# Altium schematic sheet IB_V2_POWER.SchDoc
size A2; SheetNumber: 5; SheetTotal: 5
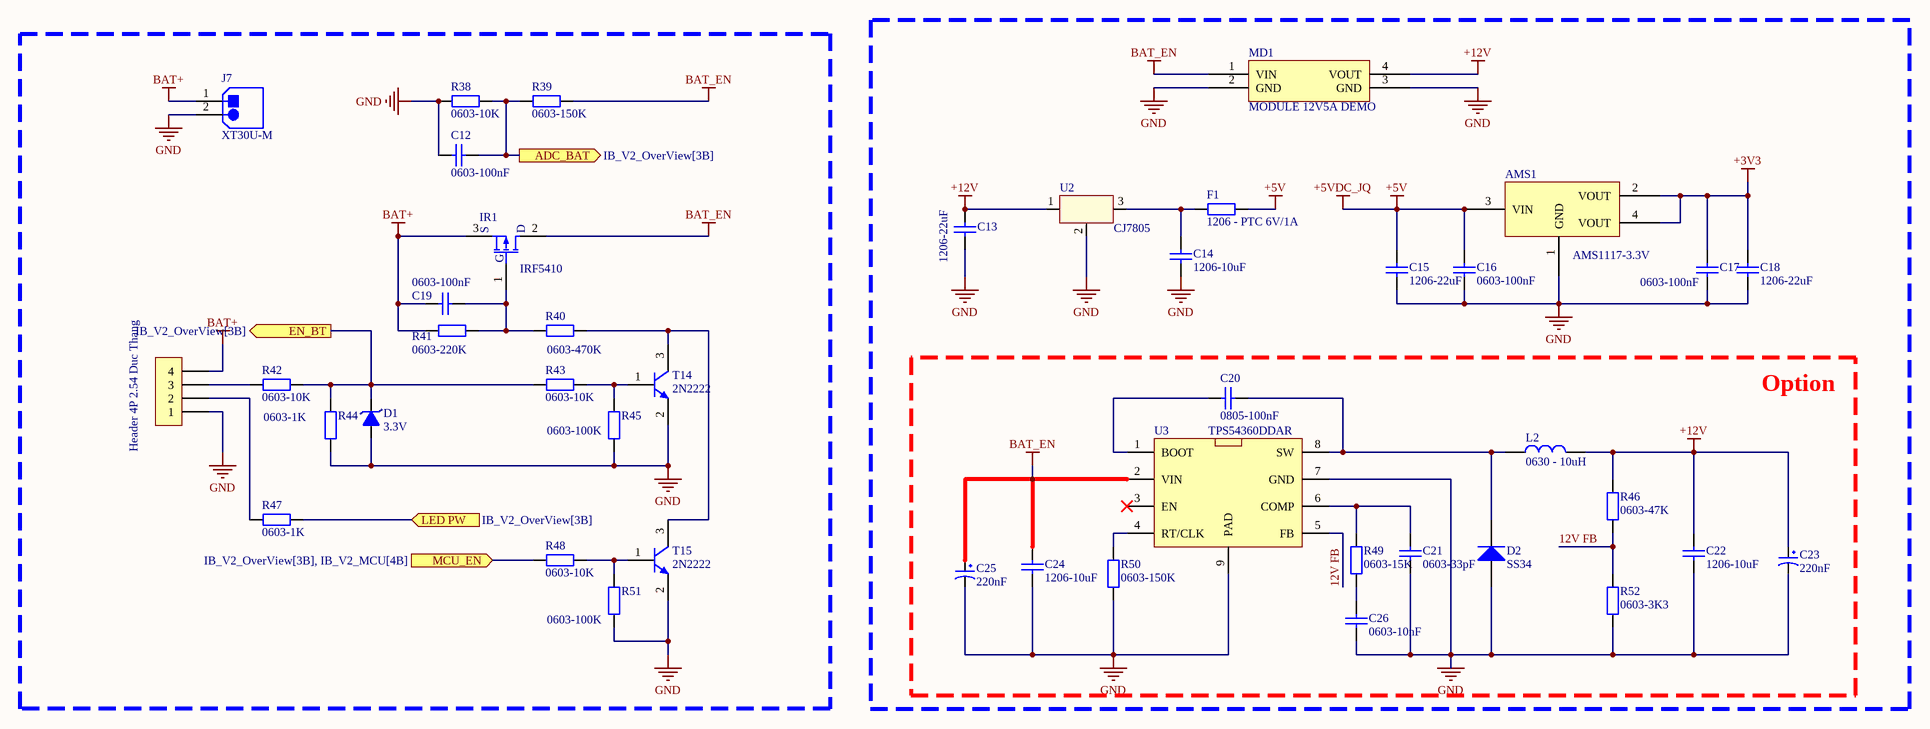
[diagram p0: IB_V2_POWER.SchDoc]

## Parts
AMS1  AMS1117-3.3V  [SOT223]
C12  0603-100nF  [Cap 0603]
C13  1206-22uF  [Cap 1206]
C14  1206-10uF  [Cap 1206]
C15  1206-22uF  [Cap 1206]
C16  0603-100nF  [Cap 0603]
C17  0603-100nF  [Cap 0603]
C18  1206-22uF  [Cap 1206]
C19  0603-100nF  [Cap 0603]
C20  0805-100nF  [Cap 0805]
C21  0603-33pF  [Cap 0603]
C22  1206-10uF  [Cap 1206]
C23  220nF  [tu hoa 8mm]
C24  1206-10uF  [Cap 1206]
C25  220nF  [tu hoa 8mm]
C26  0603-10nF  [Cap 0603]
D1  3.3V  [DIODE ZENNER SMD SOD80]
D2  SS34  [DIODE SMA]
F1  1206 - PTC 6V/1A  [tro smd 1206]
H7  Header 4P 2.54 Duc Thang  [XH2.54M-4]
IR1  IRF5410  [TO-252]
J7  XT30U-M  [XT30U]
L2  0630 - 10uH  [0630_Inductor]
MD1  MODULE 12V5A DEMO  [MODULE 12V5A]
R38  0603-10K  [RES 0603]
R39  0603-150K  [RES 0603]
R40  0603-470K  [RES 0603]
R41  0603-220K  [RES 0603]
R42  0603-10K  [RES 0603]
R43  0603-10K  [RES 0603]
R44  0603-1K  [RES 0603]
R45  0603-100K  [RES 0603]
R46  0603-47K  [RES 0603]
R47  0603-1K  [RES 0603]
R48  0603-10K  [RES 0603]
R49  0603-15K  [RES 0603]
R50  0603-150K  [RES 0603]
R51  0603-100K  [RES 0603]
R52  0603-3K3  [RES 0603]
T14  2N2222  [SOT - 23]
T15  2N2222  [SOT - 23]
U2  CJ7805  [To263 2L]
U3  TPS54360DDAR  [SOIC-8-EP]

## Blocks framed on the sheet
Option: C20-C26 D2 L2 R46 R49 R50 R52 U3

## Ports
ADC_BAT (out, see IB_V2_OverView[3B]), EN_BT (out, see IB_V2_OverView[3B]), LED PW (in, see IB_V2_OverView[3B]), MCU_EN (in, see IB_V2_OverView[3B], IB_V2_MCU[4B])

## Nets
+3V3: AMS1.2(VOUT) AMS1.4(VOUT) C17.1 C18.1
+5V: AMS1.3(VIN) C15.1 C16.1 F1.2  [also labelled +5VDC_JQ]
+12V: C13.1 C22.1 C23.1 L2.2 MD1.4(VOUT) R46.2 U2.1(Vin)
BAT+: C19.1 H7.4 IR1.3(S) J7.1 R41.1
BAT_EN: C24.1 C25.1 IR1.2(D) MD1.1(VIN) R39.1 U3.2(VIN)
GND: AMS1.1(GND) C12.1 C13.2 C14.2 C15.2 C16.2 C17.2 C18.2 C21.2 C22.2 C23.2 C24.2 C25.2 C26.2 D1.1(A) D2.1(A) H7.1 J7.2 MD1.2(GND) MD1.3(GND) R38.2 R44.1 R45.1 R50.1 R51.1 R52.1 T14.2(E) T15.2(E) U2.2(GND) U3.7(GND) U3.9(PAD)
12V FB: R46.1 R52.2 U3.5(FB)
ADC_BAT: C12.2 R38.1 R39.2 ; port ADC_BAT
EN_BT: D1.2(K) R42.2 R43.1 R44.2 ; port EN_BT
LED PW: R47.2 ; port LED PW
MCU_EN: R48.1 ; port MCU_EN
NetC14_1: C14.1 F1.1 U2.3(Vout)
NetC19_2: C19.2 IR1.1(G) R40.1 R41.2
NetC20_1: C20.1 D2.2(K) L2.1 U3.8(SW)
NetC20_2: C20.2 U3.1(BOOT)
NetC21_1: C21.1 R49.2 U3.6(COMP)
NetC26_1: C26.1 R49.1
NetH7_2: H7.2 R47.1
NetH7_3: H7.3 R42.1
NetR40_2: R40.2 T14.3(C) T15.3(C)
NetR43_2: R43.2 R45.2 T14.1(B)
NetR48_2: R48.2 R51.2 T15.1(B)
NetR50_2: R50.2 U3.4(RT/CLK)

Not connected (* = marked no-connect by the designer): U3 3(EN)*

## Library data of the parts
AMS1 = AMS1117 SMD: Dán; Value: AMS1117-3.3V SOT223; Don_Vi: Con; Ma_Hang: MH000596; Ghi_Chu: *; Kieu_Chan: *; Chung_Loai: Dán
C12 C16 C17 C19 = Cap 0603 100nF: 50V 100nF X7R ±5% 0603 Multilayer Ceramic Capacitors MLCC - SMD/SMT ROHS; ComponentLink1Description: LCSC ref link; ComponentLink1URL: https://www.lcsc.com/product-detail/Multilayer-Ceramic-Capacitors-MLCC-SMD-SMT_YAGEO-CC0603JRX7R9BB104_C91183.html?s_z=n_100nF%25200603%2520cap%252050v; Package: 0603
C13 C15 C18 = Cap 1206 22uF: 25V 22uF X5R ±10% 1206 Multilayer Ceramic Capacitors MLCC - SMD/SMT ROHS; ComponentLink1Description: LCSC ref link; ComponentLink1URL: https://www.lcsc.com/product-detail/Multilayer-Ceramic-Capacitors-MLCC-SMD-SMT_Samsung-Electro-Mechanics-CL31A226KAHNNNE_C12891.html?s_z=n_22uF%25201206%2520cap%252050v; Package: 1206
C14 C22 C24 = Cap 1206 10uF: 50V 10uF X5R ±10% 1206 Multilayer Ceramic Capacitors MLCC - SMD/SMT ROHS; Package: 1206; ComponentLink1Description: LCSC ref link; ComponentLink1URL: https://www.lcsc.com/product-detail/Multilayer-Ceramic-Capacitors-MLCC-SMD-SMT_Samsung-Electro-Mechanics-CL31A106KBHNNNE_C13585.html?s_z=n_10uF%25201206%2520cap%252050v
C20 = Cap 0805 100nF: 50V 100nF X7R ±10% 0805 Multilayer Ceramic Capacitors MLCC - SMD/SMT ROHS; Package: 0805; ComponentLink1Description: LCSC ref link; ComponentLink1URL: https://www.lcsc.com/product-detail/Multilayer-Ceramic-Capacitors-MLCC-SMD-SMT_YAGEO-CC0805KRX7R9BB104_C49678.html?s_z=n_100nF%25200805%2520cap%252050v
C21 = Cap 0603 33pF: 50V 33pF C0G ±5% 0603 Multilayer Ceramic Capacitors MLCC - SMD/SMT ROHS; ComponentLink1Description: LCSC ref link; ComponentLink1URL: https://www.lcsc.com/product-detail/Multilayer-Ceramic-Capacitors-MLCC-SMD-SMT_Samsung-Electro-Mechanics-CL10C330JB8NNNC_C1663.html?s_z=n_33pF%25200603%2520cap%252050v; Package: 0603
C23 C25 = Tu Hoa 220uF 35V 8x12: Cắm; Don_Vi: Con; So_Chan: 2; Ten_Linh_Kien: Tụ Hóa 220uF 35V 8x12MM; Ma_Hang: MH006553; Chung_Loai: Cắm; Kieu_Chan: *
C26 = Cap 0603 100nF: 50V 10nF X7R ±5% 0603 Multilayer Ceramic Capacitors MLCC - SMD/SMT ROHS; ComponentLink1Description: LCSC ref link; ComponentLink1URL: https://www.lcsc.com/product-detail/Multilayer-Ceramic-Capacitors-MLCC-SMD-SMT_YAGEO-CC0603JRX7R9BB104_C91183.html?s_z=n_100nF%25200603%2520cap%252050v; Package: 0603
D1 = Diode Zener 3.3V: Dán; Don_Vi: Con; Ma_Hang: MH002880; Ten_Linh_Kien: Diode Zener 1/2W 3.3V SMD1206 ZMM3.3; Kieu_Chan: *; Ghi_Chu: *; Chung_Loai: Dán
D2 = Diode SS34 ( 1N5822 ): Dán; Don_Vi: Con; Ma_Hang: MH002104; Ten_Linh_Kien: Diode SS34 3A 40V SMA ( 1N5822 SS34A); Kieu_Chan: *; Chung_Loai: Dán
F1 = Tro 1206 1% 10R: Dán; Don_Vi: Con; So_Chan: 2; Ten_Linh_Kien: Trở 1206 1% 10R; Ma_Hang: MH005886; Chung_Loai: Dán; Kieu_Chan: *
H7 = Header 4P 2.54 Duc Thang: Cắm; Ten_Linh_Kien: Header 4P XH2.54-4P Đực Thẳng; Don_Vi: Con; Ma_Hang: MH001285; Chung_Loai: Cắm
IR1 = Mosfet - DTU40P06
J7 = XT30U-M: Socket; DC supply; XT30; male; PIN: 2; on PCBs; THT; Colour: yellow
L2 = 0630_Inductor
R38 R46 = Res 0603 47K: 100mW Thick Film Resistors 75V ±100ppm/℃ ±1% 47kΩ 0603 Chip Resistor - Surface Mount ROHS; ComponentLink1Description: LCSC ref link; ComponentLink1URL: https://www.lcsc.com/product-detail/Chip-Resistor-Surface-Mount_YAGEO-RC0603FR-0747KL_C105579.html?s_z=n_47k%25200603%2520res; Package: 0603
R39 = Res 0603 820K: 100mW Thick Film Resistors 75V ±100ppm/℃ ±1% 820kΩ 0603 Chip Resistor - Surface Mount ROHS; Package: 0603; ComponentLink1Description: LCSC ref link; ComponentLink1URL: https://www.lcsc.com/product-detail/Chip-Resistor-Surface-Mount_YAGEO-RC0603FR-07820KL_C141684.html?s_z=n_820k%25200603%2520res
R40 = Res 0603 470K: 100mW Thick Film Resistors 75V ±100ppm/℃ ±1% 470kΩ 0603 Chip Resistor - Surface Mount ROHS; ComponentLink1Description: LCSC ref link; ComponentLink1URL: https://www.lcsc.com/product-detail/Chip-Resistor-Surface-Mount_YAGEO-RC0603FR-07470KL_C114622.html?s_z=n_470k%25200603%2520res; Package: 0603
R41 = Res 0603 220K: 100mW Thick Film Resistors 75V ±100ppm/℃ ±1% 220kΩ 0603 Chip Resistor - Surface Mount ROHS; ComponentLink1Description: LCSC ref link; ComponentLink1URL: https://www.lcsc.com/product-detail/Chip-Resistor-Surface-Mount_YAGEO-RC0603FR-07220KL_C123420.html?s_z=n_220k%25200603%2520res; Package: 0603
R42 R43 R48 = Res 0603 10K: 0.1W Thick Film Resistors 75V ±100ppm/℃ ±1% 10kΩ 0603 Chip Resistor - Surface Mount ROHS; ComponentLink1Description: LCSC ref link; ComponentLink1URL: https://www.lcsc.com/product-detail/Chip-Resistor-Surface-Mount_UNI-ROYAL-Uniroyal-Elec-0603WAF1002T5E_C25804.html?s_z=s_Resistors%257CChip%2520Resistor%2520-%2520Surface%2520Mount; Package: 0603
R44 R47 = Res 0603 1K: 0.1W Thick Film Resistors 75V ±100ppm/℃ ±1% 1kΩ 0603 Chip Resistor - Surface Mount ROHS; ComponentLink1Description: LCSC ref link; ComponentLink1URL: https://www.lcsc.com/product-detail/Chip-Resistor-Surface-Mount_UNI-ROYAL-Uniroyal-Elec-0603WAF1001T5E_C21190.html?s_z=s_Resistors%257CChip%2520Resistor%2520-%2520Surface%2520Mount; Package: 0603
R45 R51 = Res 0603 100K: 100mW Thick Film Resistors 75V ±100ppm/℃ ±1% 100kΩ 0603 Chip Resistor - Surface Mount ROHS; ComponentLink1Description: LCSC ref link; ComponentLink1URL: https://www.lcsc.com/product-detail/Chip-Resistor-Surface-Mount_YAGEO-RC0603FR-07100KL_C14675.html?s_z=n_100k%25200603%2520res; Package: 0603
R49 = Res 0603 15K: 100mW Thick Film Resistors 75V ±100ppm/℃ ±1% 15kΩ 0603 Chip Resistor - Surface Mount ROHS; ComponentLink1Description: LCSC ref link; ComponentLink1URL: https://www.lcsc.com/product-detail/Chip-Resistor-Surface-Mount_YAGEO-RC0603FR-0715KL_C114661.html?s_z=n_15k%25200603%2520res; Package: 0603
R50 = Res 0603 150K: 100mW Thick Film Resistors 75V ±100ppm/℃ ±1% 150kΩ 0603 Chip Resistor - Surface Mount ROHS; ComponentLink1Description: LCSC ref link; ComponentLink1URL: https://www.lcsc.com/product-detail/Chip-Resistor-Surface-Mount_YAGEO-RC0603FR-07150KL_C114660.html?s_z=n_150k%25200603%2520res; Package: 0603
R52 = Res 0603 3K3: 100mW Thick Film Resistors 75V ±100ppm/℃ ±1% 3.3kΩ 0603 Chip Resistor - Surface Mount ROHS; ComponentLink1Description: LCSC ref link; ComponentLink1URL: https://www.lcsc.com/product-detail/Chip-Resistor-Surface-Mount_YAGEO-RC0603FR-073K3L_C108078.html?s_z=n_3k3%25200603%2520res; Package: 0603
T14 T15 = Transistor - 2N2222
U2 = 7805
U3 = TPS54360DDAR: Step-down type 800mV~58.8V 3.5A 4.5V~60V SOIC-8-EP DC-DC Converters ROHS; ComponentLink1Description: LCSC ref link; ComponentLink1URL: https://www.lcsc.com/product-detail/DC-DC-Converters_Texas-Instruments-TPS54360DDAR_C44377.html?s_z=n_tps54360; Package: SOIC-8-EP